# Altium schematic sheet Headers.SchDoc
size A4; SheetNumber: 3; SheetTotal: 3
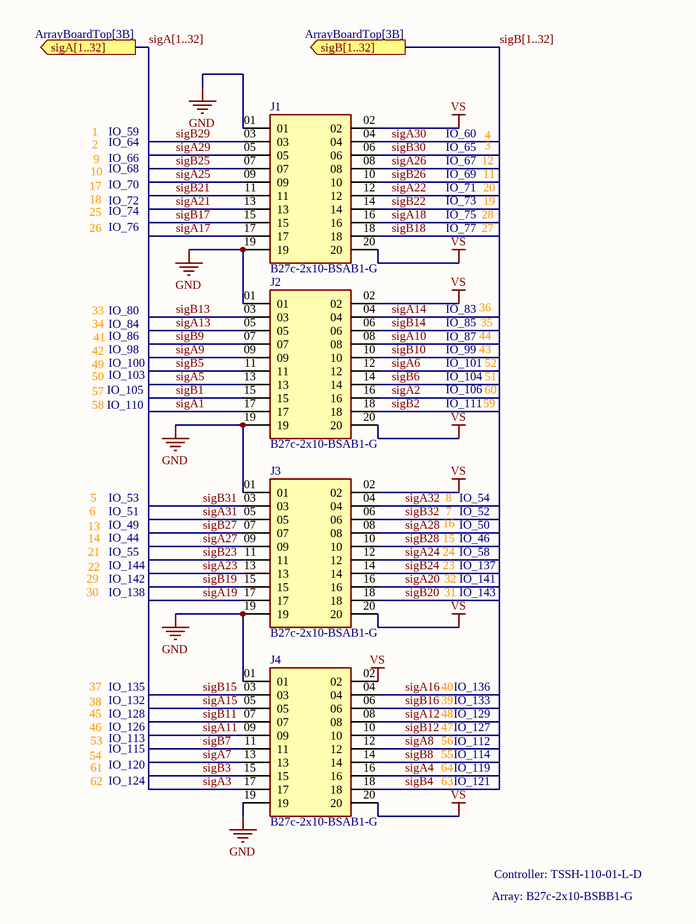
[diagram p0: Headers.SchDoc]

## Parts
J1  B27c-2x10-BSAB1-G  [B27C SMT2x10]
J2  B27c-2x10-BSAB1-G  [B27C SMT2x10]
J3  B27c-2x10-BSAB1-G  [B27C SMT2x10]
J4  B27c-2x10-BSAB1-G  [B27C SMT2x10]

## Ports
sigA[1..32] (out, see ArrayBoardTop[3B]), sigB[1..32] (out, see ArrayBoardTop[3B])

## Nets
GND: J1.01 J1.19 J2.01 J2.19 J3.01 J3.19 J4.01 J4.19
VS: J1.02 J1.20 J2.02 J2.20 J3.02 J3.20 J4.02 J4.20
sigA1: J2.17
sigA2: J2.16
sigA3: J4.17
sigA4: J4.16
sigA5: J2.13
sigA6: J2.12
sigA7: J4.13
sigA8: J4.12
sigA9: J2.09
sigA10: J2.08
sigA11: J4.09
sigA12: J4.08
sigA13: J2.05
sigA14: J2.04
sigA15: J4.05
sigA16: J4.04
sigA17: J1.17
sigA18: J1.16
sigA19: J3.17
sigA20: J3.16
sigA21: J1.13
sigA22: J1.12
sigA23: J3.13
sigA24: J3.12
sigA25: J1.09
sigA26: J1.08
sigA27: J3.09
sigA28: J3.08
sigA29: J1.05
sigA30: J1.04
sigA31: J3.05
sigA32: J3.04
sigB1: J2.15
sigB2: J2.18
sigB3: J4.15
sigB4: J4.18
sigB5: J2.11
sigB6: J2.14
sigB7: J4.11
sigB8: J4.14
sigB9: J2.07
sigB10: J2.10
sigB11: J4.07
sigB12: J4.10
sigB13: J2.03
sigB14: J2.06
sigB15: J4.03
sigB16: J4.06
sigB17: J1.15
sigB18: J1.18
sigB19: J3.15
sigB20: J3.18
sigB21: J1.11
sigB22: J1.14
sigB23: J3.11
sigB24: J3.14
sigB25: J1.07
sigB26: J1.10
sigB27: J3.07
sigB28: J3.10
sigB29: J1.03
sigB30: J1.06
sigB31: J3.03
sigB32: J3.06

## Buses and harness runs
bus sigA[1..32] = port sigA[1..32]
bus sigB[1..32] = port sigB[1..32]

## Notes on the sheet
- 10
- 1
- 2
- 9
- IO_59
- IO_64
- IO_66
- IO_68
- IO_60
- IO_65
- IO_67
- IO_69
- 12
- 11
- 3
- 4
- 17
- 18
- 25
- 26
- IO_70
- IO_72
- IO_74
- IO_76
- IO_71
- IO_75
- IO_77
- IO_73
- 27
- 28
- 19
- 20
- 33
- IO_80
- IO_83
- 36
- 34
- 42
- 49
- 50
- 41
- IO_84
- IO_86
- IO_98
- IO_100
- IO_103
- IO_85
- IO_99
- IO_104
- IO_87
- IO_101
- 43
- 44
- 35
- 51
- 52
- 57
- 58
- IO_105
- IO_110
- IO_111
- IO_106
- 59
- 60
- 6
- 5
- IO_53
- IO_51
- 7
- 8
- IO_54
- IO_52
- 29
- 13
- 14
- 21
- 22
- IO_49
- IO_55
- IO_142
- IO_144
- IO_44
- 15
- 16
- 23
- 24
- 32
- IO_46
- IO_50
- IO_58
- IO_137
- IO_141
- 30
- IO_138
- 31
- IO_143
- 37
- 38
- 45
- IO_128
- IO_132
- IO_135
- 39
- 40
- 48
- IO_129
- IO_133
- IO_136
- 46
- 54
- 53
- 61
- 62
- IO_126
- IO_113
- IO_115
- IO_120
- IO_124
- 47
- 55
- 56
- 63
- 64
- IO_127
- IO_114
- IO_121
- IO_112
- IO_119
- Array: B27c-2x10-BSBB1-G
- Controller: TSSH-110-01-L-D

## Library data of the parts
J1-J4 = B27c-2x10-BSAB1-G: System: Connector; Price: None; Availability: Unavailable; MP: B27c-2x10-BSAB1-G; Package: None